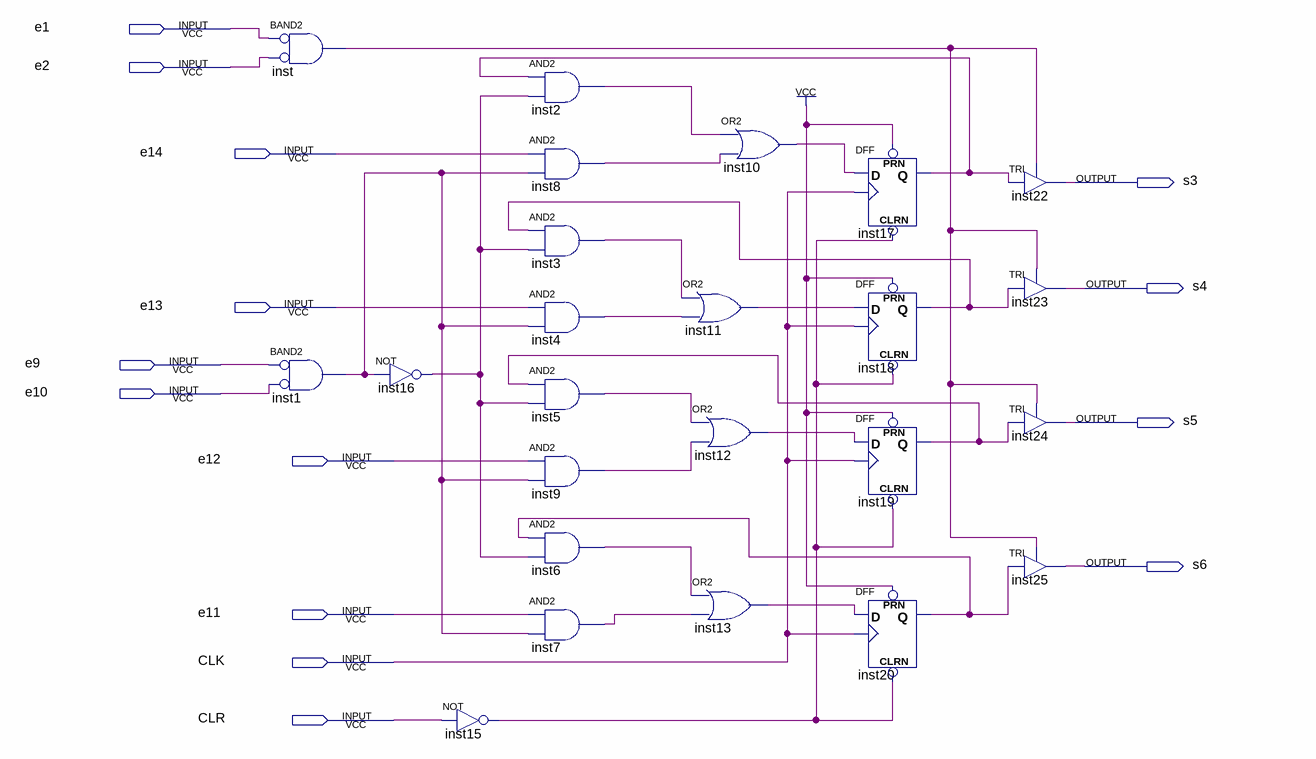
[diagram p0: schematic sheet]
// Quartus schematic Ci74LS173.bdf as structural Verilog: 24 symbols, 14 pins
module Ci74LS173 (
  input  e1,
  input  e2,
  input  e14,
  input  e13,
  input  e9,
  input  e10,
  input  e12,
  input  e11,
  input  CLK,
  input  CLR,
  output s3,
  output s4,
  output s5,
  output s6
);

  wire inst1_out, inst2_out, inst3_out, inst4_out, inst5_out, inst6_out, inst7_out, inst8_out, inst9_out,
       inst10_out, inst11_out, inst12_out, inst13_out, inst15_out, inst16_out, inst17_q, inst18_q, inst19_q,
       inst20_q, inst_out;

  and inst (inst_out, ~e1, ~e2);  // BAND2
  and inst1 (inst1_out, ~e9, ~e10);  // BAND2
  not inst16 (inst16_out, inst1_out);
  not inst15 (inst15_out, CLR);
  and inst2 (inst2_out, inst17_q, inst16_out);
  and inst8 (inst8_out, e14, inst1_out);
  and inst3 (inst3_out, inst18_q, inst16_out);
  and inst4 (inst4_out, e13, inst1_out);
  and inst5 (inst5_out, inst19_q, inst16_out);
  and inst9 (inst9_out, e12, inst1_out);
  and inst6 (inst6_out, inst20_q, inst16_out);
  and inst7 (inst7_out, e11, inst1_out);
  or inst10 (inst10_out, inst2_out, inst8_out);
  or inst11 (inst11_out, inst3_out, inst4_out);
  or inst12 (inst12_out, inst5_out, inst9_out);
  or inst13 (inst13_out, inst6_out, inst7_out);
  DFF inst17 (.CLRN(inst15_out), .CLK(CLK), .D(inst10_out), .PRN(1'b1), .Q(inst17_q));
  DFF inst18 (.CLRN(inst15_out), .CLK(CLK), .D(inst11_out), .PRN(1'b1), .Q(inst18_q));
  DFF inst19 (.CLRN(inst15_out), .CLK(CLK), .D(inst12_out), .PRN(1'b1), .Q(inst19_q));
  DFF inst20 (.CLRN(inst15_out), .CLK(CLK), .D(inst13_out), .PRN(1'b1), .Q(inst20_q));
  TRI inst22 (.IN(inst17_q), .OE(inst_out), .OUT(s3));
  TRI inst23 (.IN(inst18_q), .OE(inst_out), .OUT(s4));
  TRI inst24 (.IN(inst19_q), .OE(inst_out), .OUT(s5));
  TRI inst25 (.IN(inst20_q), .OE(inst_out), .OUT(s6));
endmodule
